# EAGLE design Eagle_final_project3 (EAGLE 9.6.2)
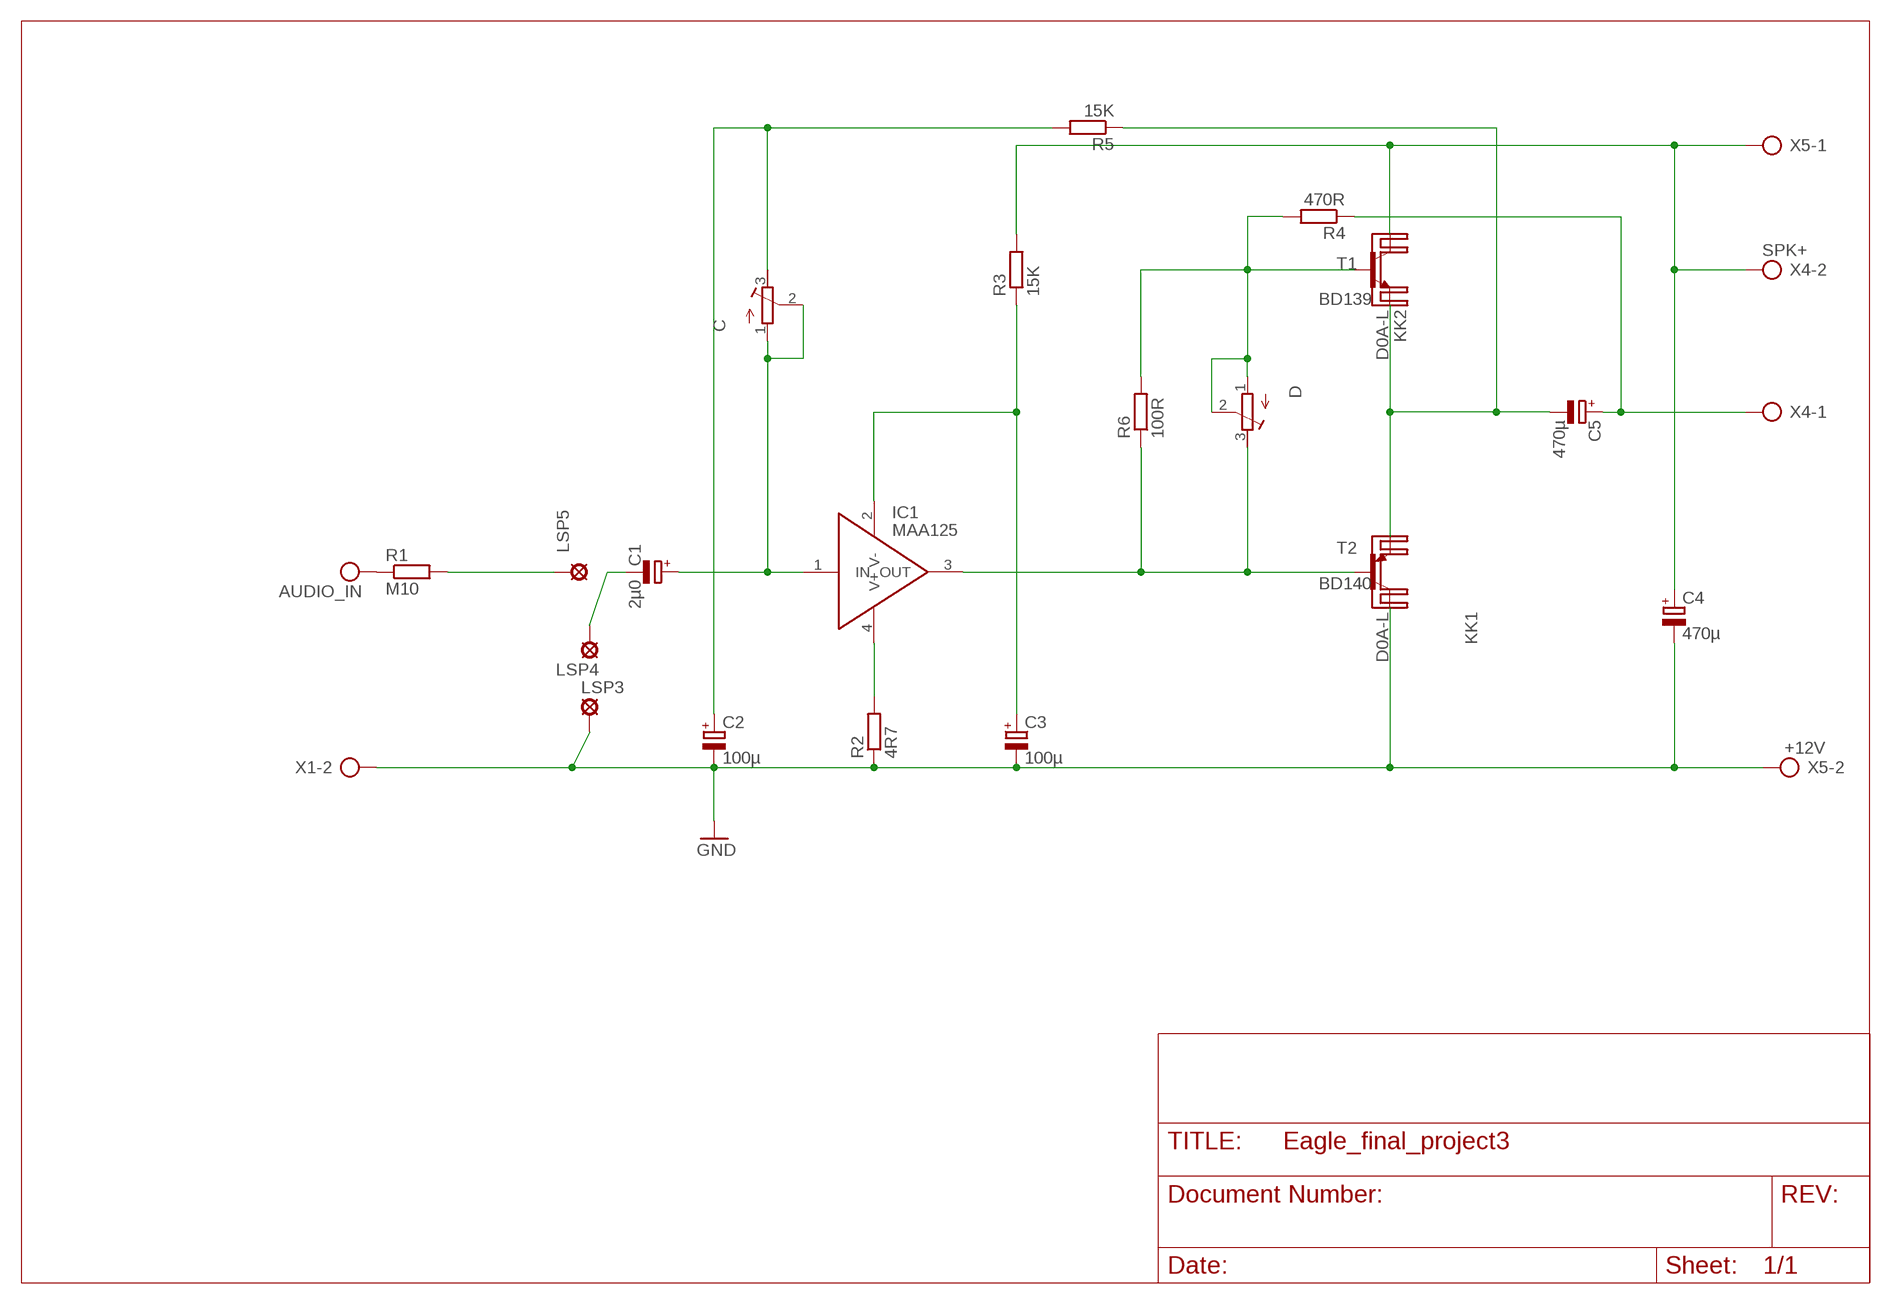
[diagram p0: schematic, sheet 1]

## Parts
C  R-TRIMM3339P  [RTRIM3339P]
C1  2µ0  CPOL-EUE2-5  [E2-5]
C2  100µ  CPOL-EUE2-5  [E2-5]
C3  100µ  CPOL-EUE2-5  [E2-5]
C4  470µ  CPOL-EUE2-5  [E2-5]
C5  470µ  CPOL-EUE2.5-6  [E2,5-6]
D  R-TRIMM3339P  [RTRIM3339P]
IC1  MAA125  [IO-1]
KK1  D0A-L  [D02A-L]
KK2  D0A-L  [D02A-L]
LSP3  LSP10  [LSP10]
LSP4  LSP10  [LSP10]
LSP5  LSP10  [LSP10]
Q1  BD139  [TO126]
R1  M10  R-EU_0207/10  [0207/10]
R2  4R7  R-EU_0207/10  [0207/10]
R3  15K  R-EU_0207/10  [0207/10]
R4  470R  R-EU_0207/10  [0207/10]
R5  15K  R-EU_0207/10  [0207/10]
R6  100R  R-EU_0207/10  [0207/10]
T2  BD140  [TO126]
X1  AUDIO_IN  AK300/2  [AK300/2]
X4  SPK+  AK300/2  [AK300/2]
X5  +12V  AK300/2  [AK300/2]

## Nets
GND: C2.- C3.- C4.- LSP3.MP R2.1 T2.2(C) X1.2 X5.2
N$1: LSP5.MP R1.2
N$2: C1.+ C.1(A) C.2(S) IC1.1(IN)
N$3: D.3(E) IC1.3(OUT) R6.1 T2.3(B)
N$4: IC1.4(V+) R2.2
N$5: C3.+ IC1.2(V-) R3.1
N$6: C2.+ C.3(E) R5.2
N$7: C5.+ R4.1 X4.1
N$8: C4.+ Q1.2(C) R3.2 X4.2 X5.1
N$11: C5.- Q1.1(E) R5.1 T2.1(E)
N$12: C1.- LSP4.MP
N$14: R1.1 X1.1
T1: D.1(A) D.2(S) Q1.3(B) R4.2 R6.2

## Library data of the parts
C D = rcl:R-TRIMM: Trimm resistor; SPICEMODEL: X; SPICEPREFIXL: POT
C1-C5 = rcl:CPOL-EU: POLARIZED CAPACITOR, European symbol; SPICEPREFIX: C
IC1 = Cad_library:MAA125: Tesla MAA125 amplifier
KK1 KK2 = heatsink:D0A-L: HEATSINK distributor Schukat
LSP3-LSP5 = solpad:LSP10: SOLDER PAD drill 1.0 mm, distributor Buerklin, 12H555
Q1 = transistor-npn:BD139*: NPN Transistor
R1-R6 = rcl:R-EU_: RESISTOR, European symbol; SPICEPREFIX: R
T2 = transistor-pnp:BD140: PNP Transistor
X1 X4 X5 = con-ptr500:AK300/2: CONNECTOR; OC_FARNELL: unknown; OC_NEWARK: unknown

## Board
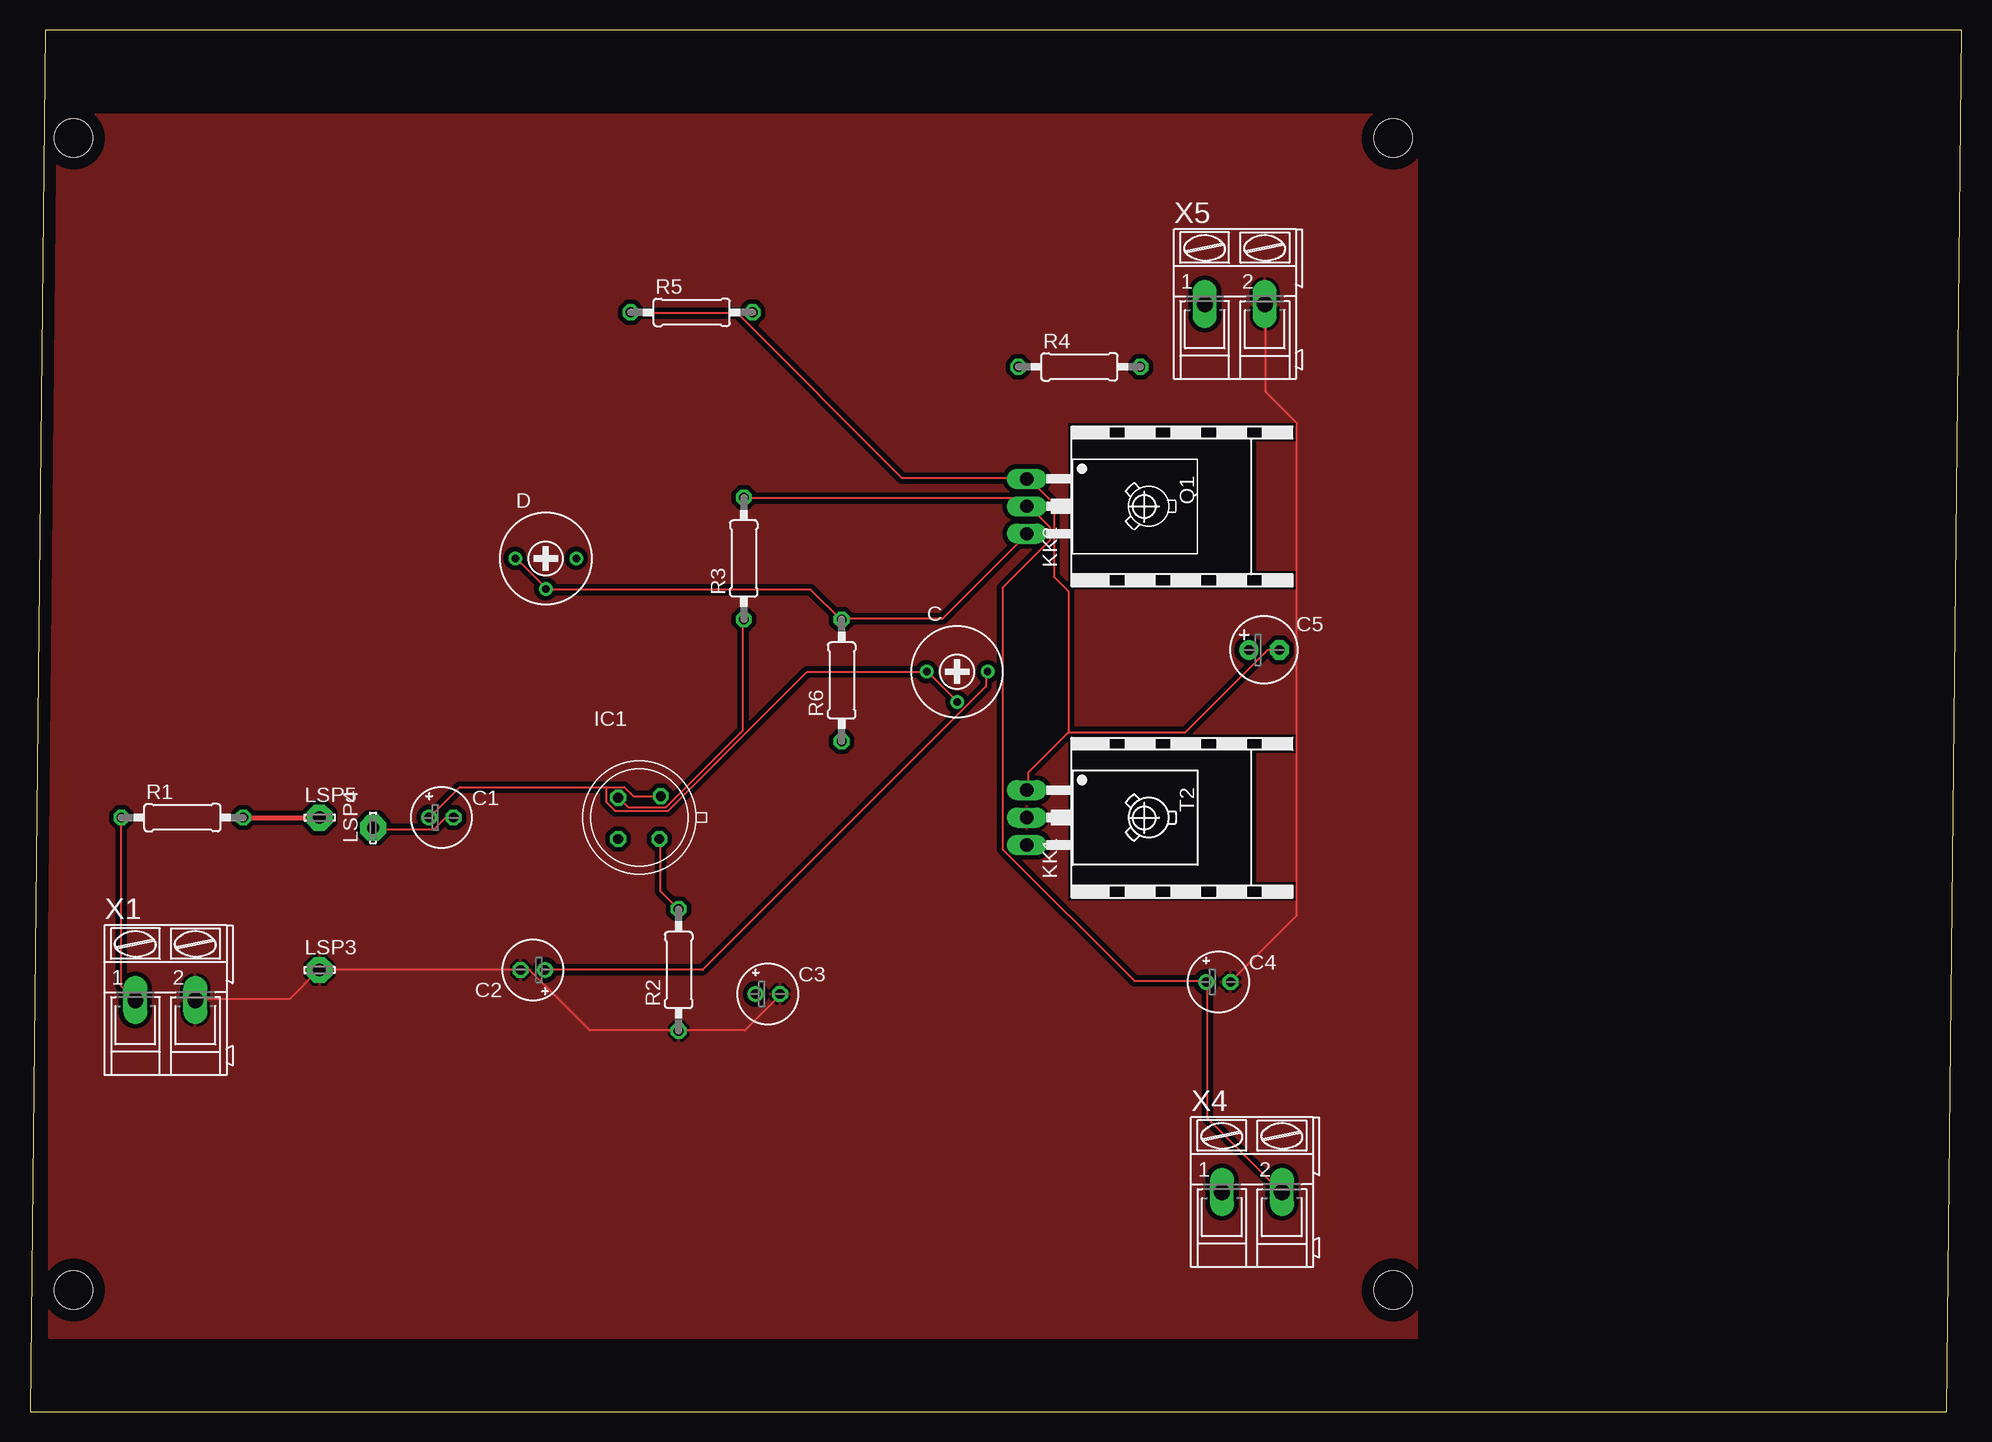
[diagram p1: board, top side]
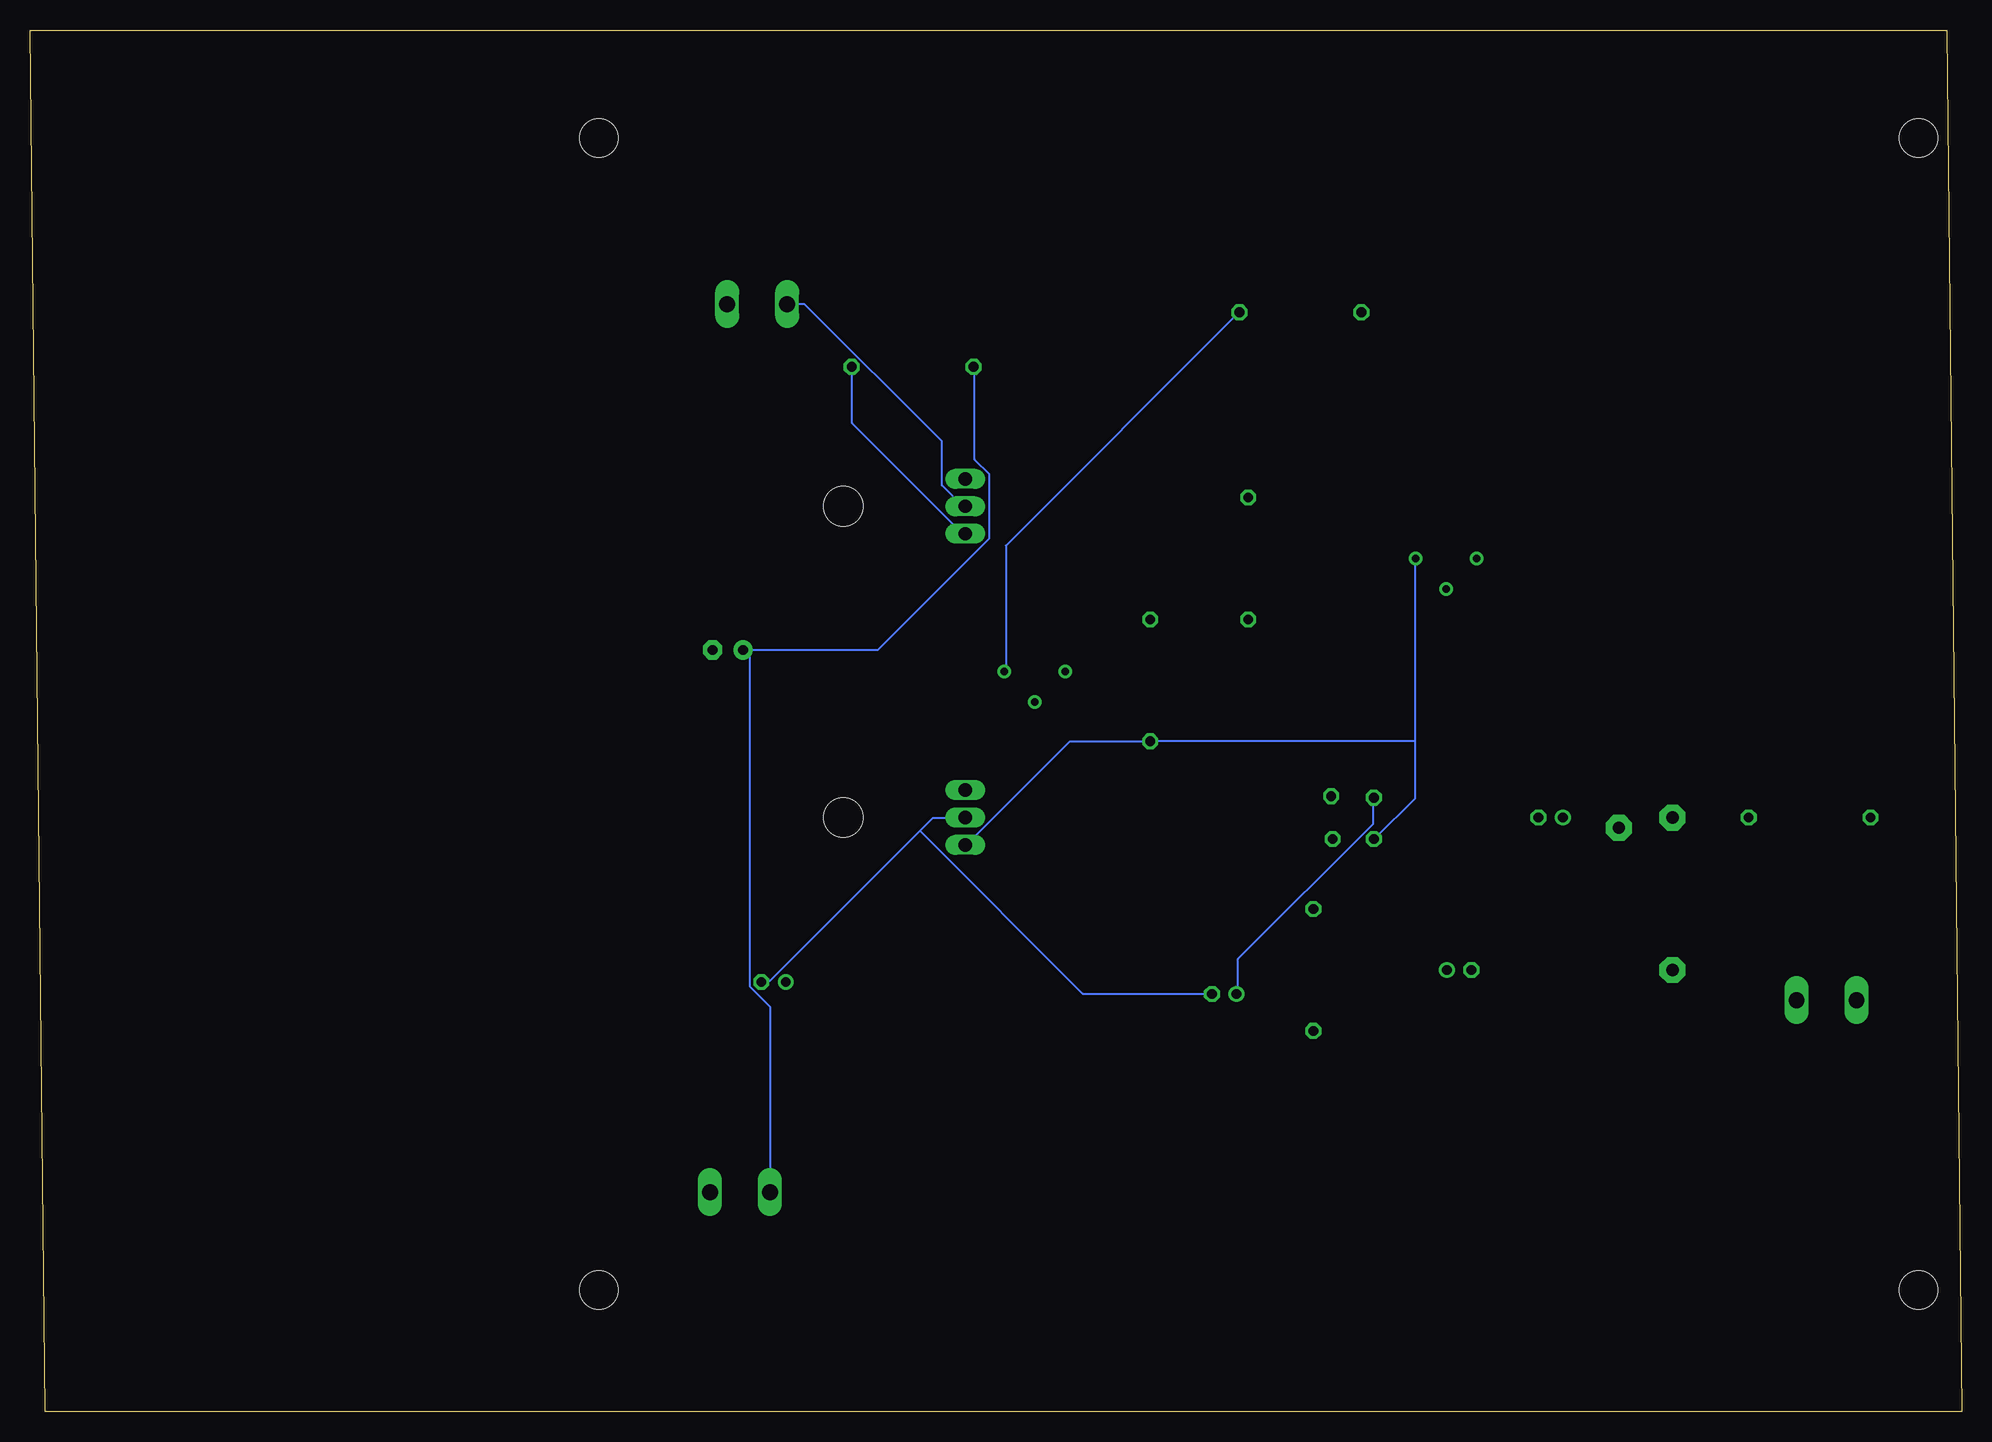
[diagram p2: board, bottom side, seen from below]

Size 161.04 x 115.16 mm. Coordinates in mm from the lower left corner, seen from the top.
Outline: 0,0 159.77,0 161.04,115.16 1.27,115.16 0,0
Copper layers (1*16): Top 0.035mm / dielectric 1.5mm / Bottom 0.035mm
Design rules "default *": minimum track width 6mil, minimum drill 0.35mm, track to track 0.4mm, track to pad 0.4mm, pad to pad 0.4mm, via to via 0.4mm, smd to smd 0.4mm, copper to edge 40mil, drill to drill 6mil, minimum pad ring 10mil, minimum via ring 8mil, stop-mask expansion 4mil, vias tented up to drill 0mil, thermal gap 10mil
Holes 3.2 mm at 3.62,106.16 113.62,106.16 113.62,10.16 3.62,10.16

### Footprints (pad centres in the part's own frame; a part is rotated, then mirrored left to right if it is on the bottom)
RTRIM3339P = drill 0.61: 1 -2.54,0; 2 0,-2.54; 3 2.54,0
E2-5 = drill 0.813 pad 1.27: + -1.016,0 | drill 0.813 pad 1.27 octagon: - 1.016,0
E2,5-6 = drill 0.813 pad 1.6: + -1.27,0 | drill 0.813 pad 1.6 octagon: - 1.27,0
IO-1 = drill 0.8 octagon: 1 1.778,1.778; 2 -1.778,1.651; 3 -1.778,-1.778; 4 1.651,-1.778
LSP10 = drill 1.016 pad 2.159 octagon: MP 0,0
TO126 = drill 1.118 long: 1 -2.286,-5.08; 2 0,-5.08; 3 2.286,-5.08 | hole 3.302: 0,5.08
0207/10 = drill 0.813 octagon: 1 -5.08,0; 2 5.08,0
AK300/2 = drill 1.321 long: 1 -2.515,0; 2 2.489,0

### Placement (x,y rotation side)
C  77.28,61.69 0 top
C1  34.29,49.53 0 top
C2  41.91,36.83 180 top
C3  61.5,34.83 0 top
C4  99.06,35.83 0 top
C5  102.87,63.5 0 top
D  42.99,71.12 0 top
IC1  50.8,49.53 0 top
KK1  98.33,49.53 0 top
KK2  98.33,75.47 0 top
LSP3  24.13,36.83 0 top
LSP4  28.6,48.67 90 top
LSP5  24.13,49.53 0 top
Q1  88.17,75.47 270 top
R1  12.7,49.53 0 top
R2  54.07,36.83 90 top
R3  59.5,71.12 90 top
R4  87.47,87.09 0 top
R5  55.15,91.63 0 top
R6  67.66,60.96 90 top
T2  88.17,49.53 270 top
X1  11.3,34.32 0 top
X4  101.87,18.32 0 top
X5  100.44,92.32 0 top

### Tracks (layer width: path | path; a pad name or v marks a point on that pad's centre or on a via)
GND
  Top 0.152: X1.2 13.87,34.39 21.64,34.39 24.08,36.83 LSP3.MP C2.- 41.6,36.83 46.63,31.8 53.95,31.8 R2.1 54.1,31.8 59.59,31.8 62.48,34.7 C3.- | X5.2 103.02,92.3 103.02,84.99 105.61,82.4 105.61,41.4 100.13,35.92 C4.-
  Bottom 0.152: 86.87,48.41 85.8,49.48 83.21,49.48 T2.2 | 86.87,48.41 99.37,35.92 99.97,35.92 C4.- | 86.87,48.41 73.3,34.85 62.64,34.85 C3.-
  pour Top: 3.62,108.16 115.62,108.16 115.62,6.16 1.62,6.16 1.62,108.16
N$1
  Top 0.406: R1.2 LSP5.MP
N$2
  Top 0.152: C.2 77.27,59.23 74.83,61.67 C.1 74.68,61.67 64.77,61.67 53.19,50.09 48.77,50.09 48.01,50.85 48.01,52.07 | IC1.1 50.29,51.31 49.53,52.07 48.01,52.07 | 48.01,52.07 35.81,52.07 C1.+
N$3
  Bottom 0.152: T2.3 83.06,47.19 74.37,55.88 R6.1 45.57,55.88 | 45.57,55.88 45.57,51.16 48.92,47.8 IC1.3 | 45.57,55.88 45.57,71.12 D.3
N$4
  Top 0.152: IC1.4 52.58,47.65 52.58,43.38 53.95,42.01 R2.2
N$5
  Top 0.152: R3.1 59.44,65.94 59.44,56.79 53.03,50.39 49.84,50.39 49.07,51.16 IC1.2
  Bottom 0.152: IC1.2 49.07,51.16 49.07,49.02 60.35,37.74 60.35,34.85 C3.+
N$6
  Top 0.152: C2.+ 56.08,36.83 79.7,60.45 79.7,61.67 C.3
  Bottom 0.152: C.3 79.7,61.82 79.7,72.19 60.35,91.54 R5.2
N$7
  Bottom 0.152: 101.04,63.5 C5.+ 101.5,63.5 | 101.04,63.5 90.37,63.5 81.08,72.8 81.08,78.13 82.3,79.35 82.3,86.97 R4.1 | 101.04,63.5 101.04,35.46 99.37,33.78 99.37,18.39 X4.1
N$8
  Top 0.152: X4.2 104.24,18.39 98.15,24.49 98.15,35.76 C4.+ 97.99,35.92 92.05,35.92 81.08,46.89 81.08,68.68 85.04,72.64 85.04,73.71 83.21,75.54 Q1.2 83.06,75.54 82.45,76.15 59.59,76.15 R3.2
  Bottom 0.152: X5.1 97.84,92.3 96.47,92.3 85.04,80.87 85.04,77.22 83.21,75.39 Q1.2
N$11
  Top 0.152: C5.- 103.18,63.5 96.32,56.64 86.56,56.64 | 86.56,56.64 83.21,53.29 83.21,51.92 T2.1 | R5.1 50.14,91.54 58.98,91.54 72.7,77.83 83.06,77.83 Q1.1 83.21,77.83 85.34,75.69 85.34,69.6 86.56,68.38 86.56,56.64
N$12
  Top 0.152: C1.- 35.2,49.48 34.59,49.48 33.68,48.56 28.65,48.56 LSP4.MP
N$14
  Top 0.152: R1.1 7.62,35.46 8.69,34.39 X1.1
T1
  Top 0.152: D.1 40.54,71.12 42.98,68.68 D.2 43.13,68.53 65.08,68.53 67.51,66.09 R6.2 67.67,66.09 76.05,66.09 83.06,73.1 Q1.3
  Bottom 0.152: R4.2 92.51,86.97 92.51,82.4 83.21,73.1 Q1.3